# Altium schematic sheet Main.SchDoc
size A4; Date: 07.06.2021; Author: Mateusz Mróz; CompanyName: AGH; SheetNumber: 1; SheetTotal: 4
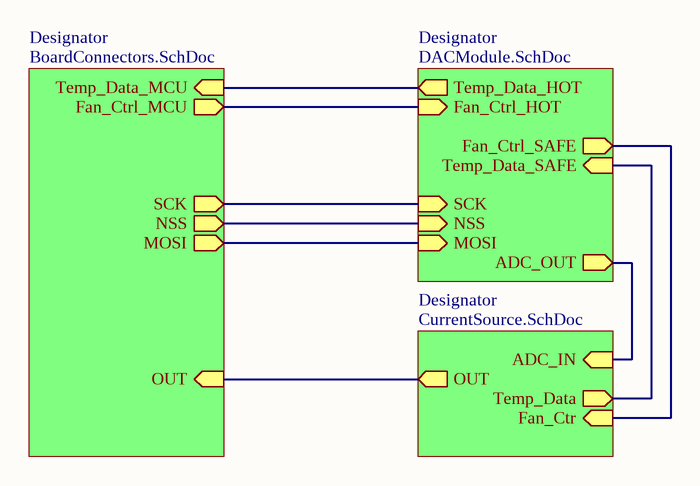
[diagram p0: Main.SchDoc]

## Sub-sheets
Designator = BoardConnectors.SchDoc: SCK (out), NSS (out), MOSI (out), OUT (in), Temp_Data_MCU (in), Fan_Ctrl_MCU (out)
Designator = DACModule.SchDoc: NSS (in), MOSI (in), SCK (in), ADC_OUT (out), Fan_Ctrl_HOT (in), Temp_Data_SAFE (in), Fan_Ctrl_SAFE (out), Temp_Data_HOT (out)
Designator = CurrentSource.SchDoc: ADC_IN (in), OUT (out), Fan_Ctr (in), Temp_Data (out)

## Nets
(unnamed): sheet Designator/SCK, sheet Designator/SCK
(unnamed): sheet Designator/NSS, sheet Designator/NSS
(unnamed): sheet Designator/MOSI, sheet Designator/MOSI
(unnamed): sheet Designator/OUT, sheet Designator/OUT
(unnamed): sheet Designator/Temp_Data_MCU, sheet Designator/Temp_Data_HOT
(unnamed): sheet Designator/Fan_Ctrl_MCU, sheet Designator/Fan_Ctrl_HOT
(unnamed): sheet Designator/ADC_OUT, sheet Designator/ADC_IN
(unnamed): sheet Designator/Temp_Data_SAFE, sheet Designator/Temp_Data
(unnamed): sheet Designator/Fan_Ctrl_SAFE, sheet Designator/Fan_Ctr

## Notes on the sheet
- University name:
- Degree course:
- 3th year electronics
- Date:
- Author:
- Student Index:
- Course:
- Checked by:
- PUE
- dr hab. inż. Cezary Worek, prof. AGH
- 305093
- Project name:
- Document name:
- Variant name:
- Sheet/all:
- /
- Version number: